# Altium schematic sheet SerialTerminations.SchDoc
size A4; SheetNumber: 6; SheetTotal: 6
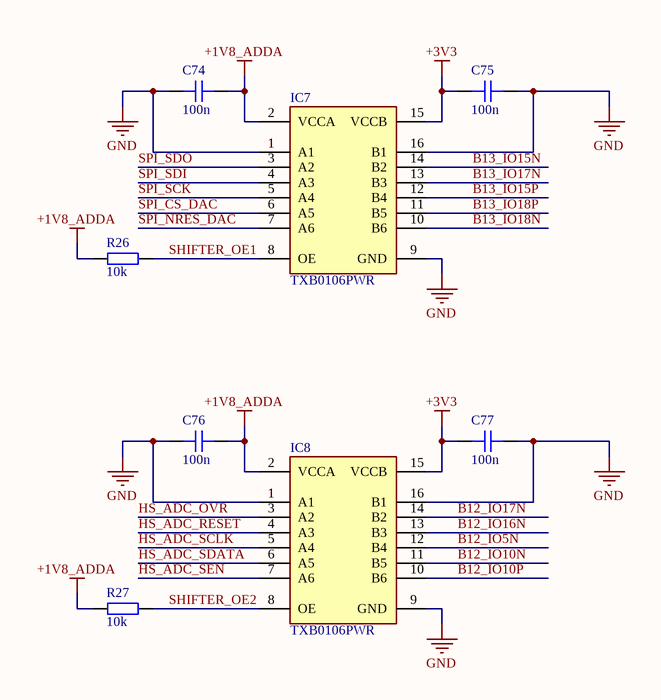
[diagram p0: SerialTerminations.SchDoc]

## Parts
C74  100n  [CAP_0402]
C75  100n  [CAP_0402]
C76  100n  [CAP_0402]
C77  100n  [CAP_0402]
IC7  TXB0106PWR  [SOP65P640X120-16N]
IC8  TXB0106PWR  [SOP65P640X120-16N]
R26  10k  [RES_0402]
R27  10k  [RES_0402]

## Nets
+1V8_ADDA: C74.2 C76.2 IC7.2(VCCA) IC8.2(VCCA) R26.1 R27.1
+3V3: C75.1 C77.1 IC7.15(VCCB) IC8.15(VCCB)
GND: C74.1 C75.2 C76.1 C77.2 IC7.1(A1) IC7.9(GND) IC7.16(B1) IC8.1(A1) IC8.9(GND) IC8.16(B1)
B12_IO5N: IC8.12(B4)
B12_IO10N: IC8.11(B5)
B12_IO10P: IC8.10(B6)
B12_IO16N: IC8.13(B3)
B12_IO17N: IC8.14(B2)
B13_IO15N: IC7.14(B2)
B13_IO15P: IC7.12(B4)
B13_IO17N: IC7.13(B3)
B13_IO18N: IC7.10(B6)
B13_IO18P: IC7.11(B5)
HS_ADC_OVR: IC8.3(A2)
HS_ADC_RESET: IC8.4(A3)
HS_ADC_SCLK: IC8.5(A4)
HS_ADC_SDATA: IC8.6(A5)
HS_ADC_SEN: IC8.7(A6)
SHIFTER_OE1: IC7.8(OE) R26.2
SHIFTER_OE2: IC8.8(OE) R27.2
SPI_CS_DAC: IC7.6(A5)
SPI_NRES_DAC: IC7.7(A6)
SPI_SCK: IC7.5(A4)
SPI_SDI: IC7.4(A3)
SPI_SDO: IC7.3(A2)

## Library data of the parts
C74-C77 = CAP_0402: Capacitor SMD 0402; Manufacturer: *; Manufacturer Part Number: *; Distributor Link: *; LCSC: *; Rating: *; Dielectric: *
IC7 IC8 = TXB0106PWR: Integrated Circuit; Manufacturer_Name: Texas Instruments; Datasheet Link: http://www.ti.com/lit/ds/symlink/txb0106.pdf; Height: 1.2mm; Manufacturer_Part_Number: TXB0106PWR; Mouser Part Number: 595-TXB0106PWR; Mouser Price/Stock: https://www.mouser.co.uk/ProductDetail/Texas-Instruments/TXB0106PWR?qs=nRD1PKnFC2EFAtrwfAB%2F4Q%3D%3D; Arrow Part Number: TXB0106PWR; Arrow Price/Stock: https://www.arrow.com/en/products/txb0106pwr/texas-instruments?utm_currency=USD&region=nac
R26 R27 = RES_0402: Resistor SMD 0402; Manufacturer: *; Manufacturer Part Number: *; Distributor Link: *; LCSC: *